# Altium schematic sheet LPCB218 - HEC5-8.SchDoc
size A3; Address1: Factory 10; Address2: 9-13 Dingley Avenue, Dandeong, VICTORIA 3175, AUSTRALIA; DocumentNumber: 7; Revision: 1; SheetNumber: 7; SheetTotal: 14; Lockie__PCB_SUB_ASSEMBLY: HEC 5-8; Lockie__PCB_ASSEMBLY: Command Node; Lockie__LDL: LPCB218; Lockie__PCB_DESCRIPTION: Command Node
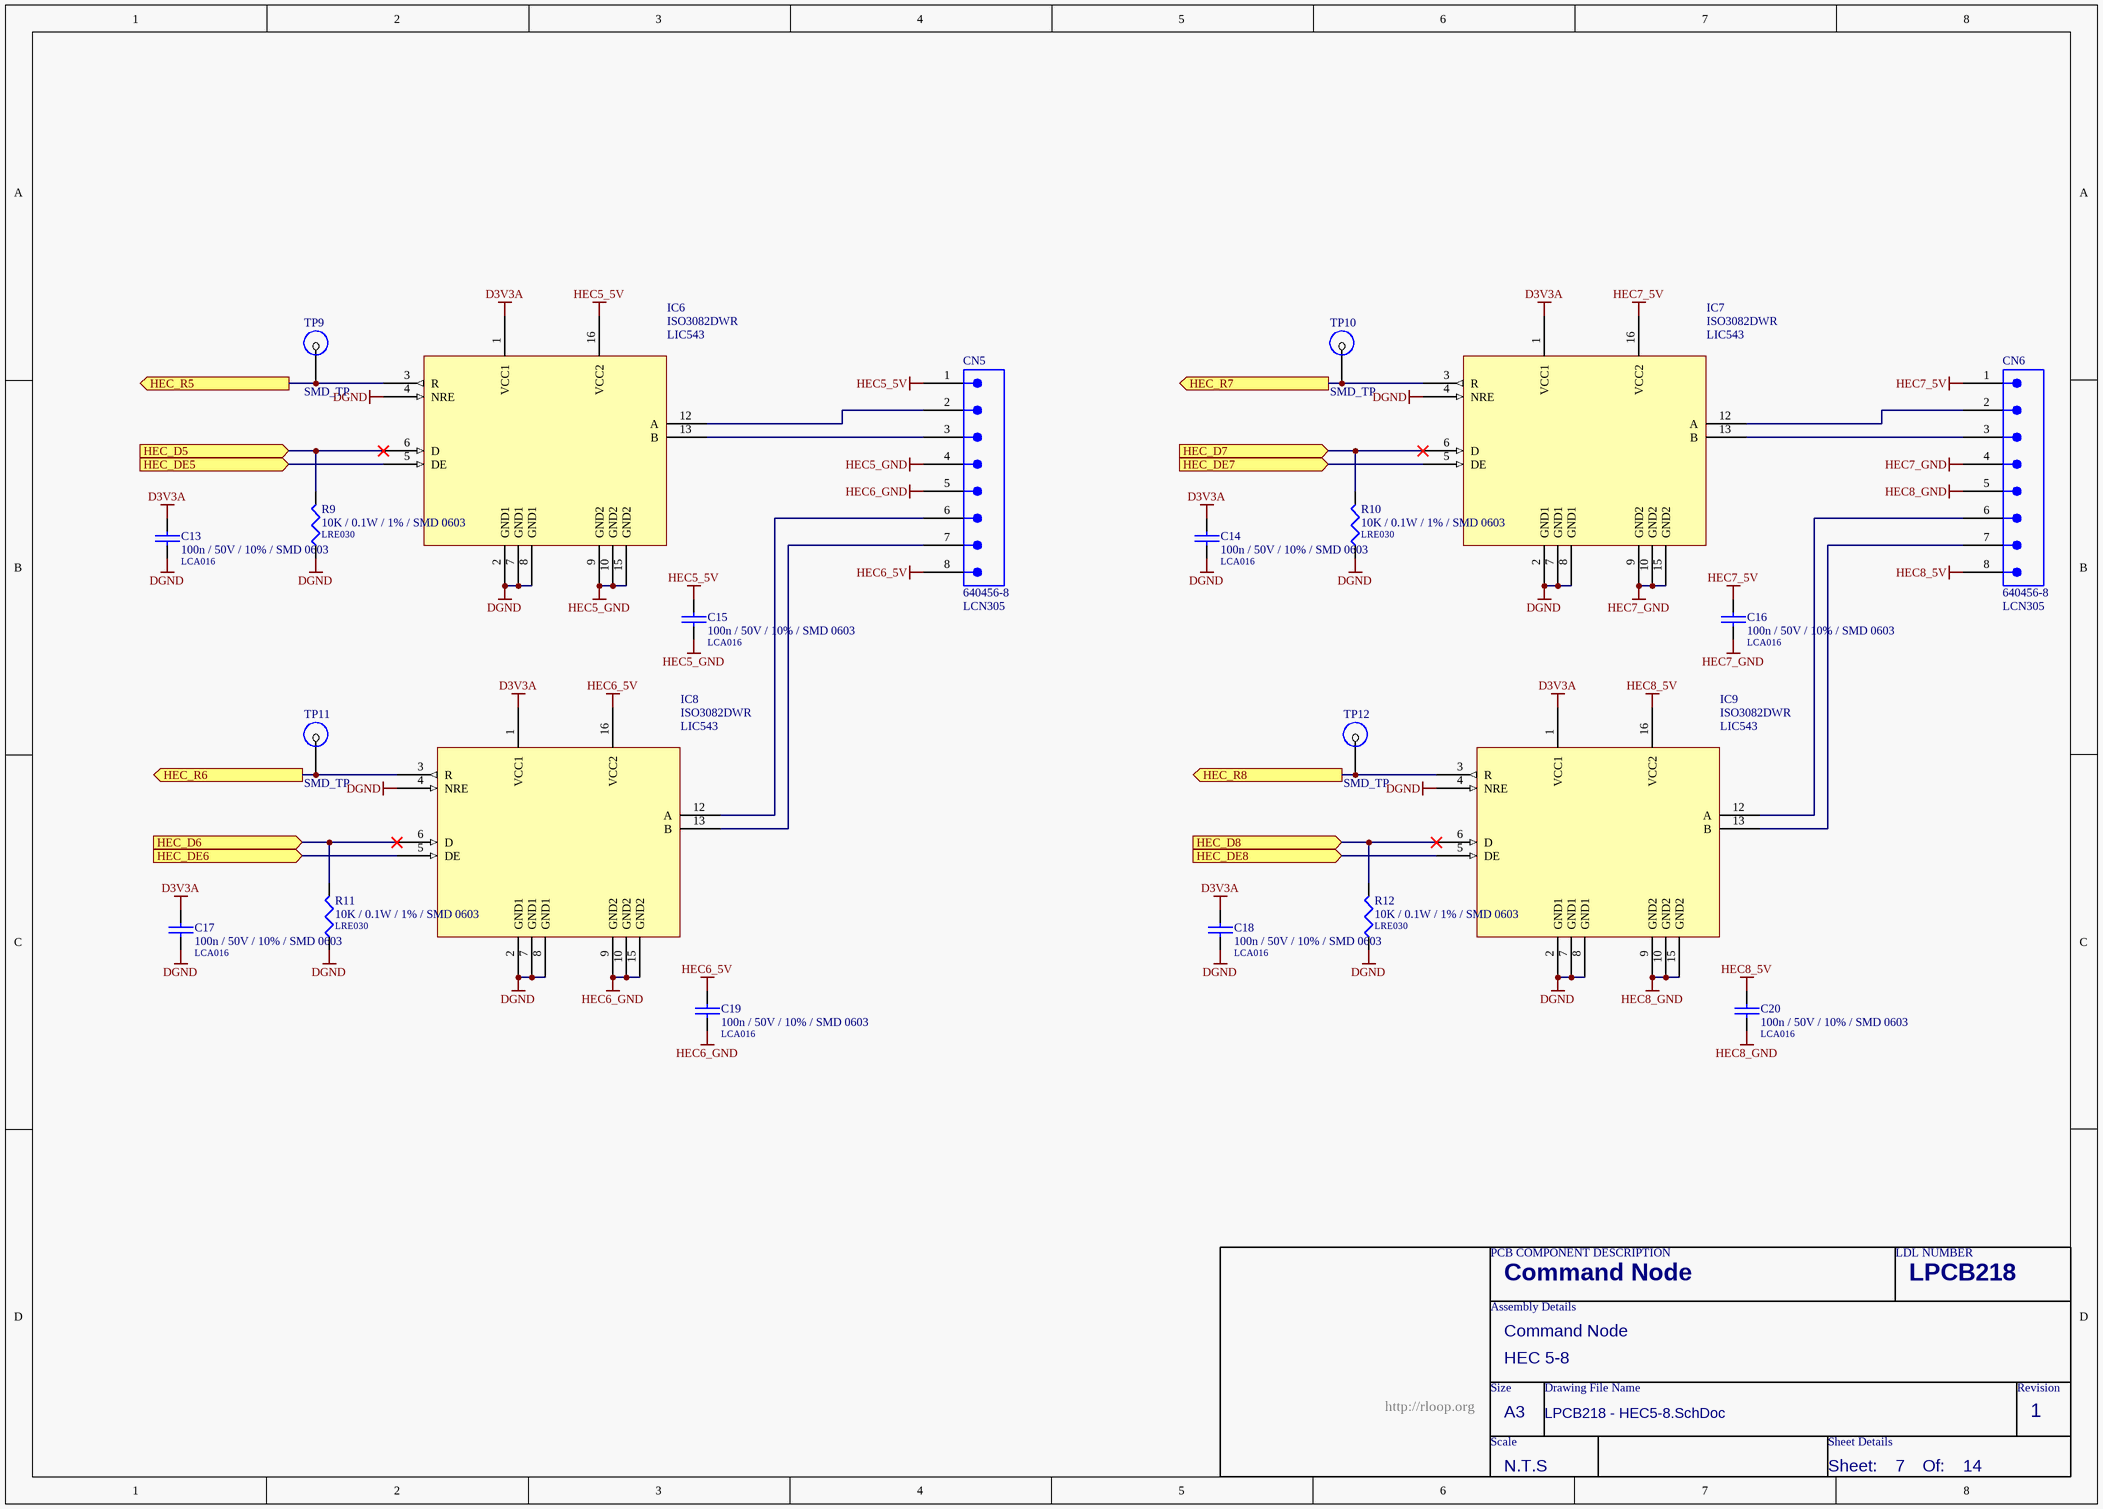
[diagram p0: LPCB218 - HEC5-8.SchDoc]

## Parts
C13  100n / 50V / 10% / SMD 0603  LDL_NUMBER: LCA016  [LFP011__CC1608-0603-IPC7351_B]
C14  100n / 50V / 10% / SMD 0603  LDL_NUMBER: LCA016  [LFP011__CC1608-0603-IPC7351_B]
C15  100n / 50V / 10% / SMD 0603  LDL_NUMBER: LCA016  [LFP011__CC1608-0603-IPC7351_B]
C16  100n / 50V / 10% / SMD 0603  LDL_NUMBER: LCA016  [LFP011__CC1608-0603-IPC7351_B]
C17  100n / 50V / 10% / SMD 0603  LDL_NUMBER: LCA016  [LFP011__CC1608-0603-IPC7351_B]
C18  100n / 50V / 10% / SMD 0603  LDL_NUMBER: LCA016  [LFP011__CC1608-0603-IPC7351_B]
C19  100n / 50V / 10% / SMD 0603  LDL_NUMBER: LCA016  [LFP011__CC1608-0603-IPC7351_B]
C20  100n / 50V / 10% / SMD 0603  LDL_NUMBER: LCA016  [LFP011__CC1608-0603-IPC7351_B]
CN5  640456-8  LDL_NUMBER: LCN305  [640456-8]
CN6  640456-8  LDL_NUMBER: LCN305  [640456-8]
IC6  ISO3082DWR  LDL_NUMBER: LIC543  [LFP068__SO-G16/G6.9]
IC7  ISO3082DWR  LDL_NUMBER: LIC543  [LFP068__SO-G16/G6.9]
IC8  ISO3082DWR  LDL_NUMBER: LIC543  [LFP068__SO-G16/G6.9]
IC9  ISO3082DWR  LDL_NUMBER: LIC543  [LFP068__SO-G16/G6.9]
R9  10K / 0.1W / 1% / SMD 0603  LDL_NUMBER: LRE030  [LFP020__CR1608-0603-IPC7351_B]
R10  10K / 0.1W / 1% / SMD 0603  LDL_NUMBER: LRE030  [LFP020__CR1608-0603-IPC7351_B]
R11  10K / 0.1W / 1% / SMD 0603  LDL_NUMBER: LRE030  [LFP020__CR1608-0603-IPC7351_B]
R12  10K / 0.1W / 1% / SMD 0603  LDL_NUMBER: LRE030  [LFP020__CR1608-0603-IPC7351_B]
TP9  SMD_TP  [SMD-TP]  (no BOM)
TP10  SMD_TP  [SMD-TP]  (no BOM)
TP11  SMD_TP  [SMD-TP]  (no BOM)
TP12  SMD_TP  [SMD-TP]  (no BOM)

## Ports
HEC_D5 (in), HEC_D6 (in), HEC_D7 (in), HEC_D8 (in), HEC_DE5 (in), HEC_DE6 (in), HEC_DE7 (in), HEC_DE8 (in), HEC_R5 (out), HEC_R6 (out), HEC_R7 (out), HEC_R8 (out)

## Nets
D3V3A: C13.1 C14.1 C17.1 C18.1 IC6.1(VCC1) IC7.1(VCC1) IC8.1(VCC1) IC9.1(VCC1)
DGND: C13.2 C14.2 C17.2 C18.2 IC6.2(GND1) IC6.4(NRE) IC6.7(GND1) IC6.8(GND1) IC7.2(GND1) IC7.4(NRE) IC7.7(GND1) IC7.8(GND1) IC8.2(GND1) IC8.4(NRE) IC8.7(GND1) IC8.8(GND1) IC9.2(GND1) IC9.4(NRE) IC9.7(GND1) IC9.8(GND1) R9.1 R10.1 R11.1 R12.1
HEC5_5V: C15.1 CN5.1 IC6.16(VCC2)
HEC5_GND: C15.2 CN5.4 IC6.9(GND2) IC6.10(GND2) IC6.15(GND2)
HEC6_5V: C19.1 CN5.8 IC8.16(VCC2)
HEC6_GND: C19.2 CN5.5 IC8.9(GND2) IC8.10(GND2) IC8.15(GND2)
HEC7_5V: C16.1 CN6.1 IC7.16(VCC2)
HEC7_GND: C16.2 CN6.4 IC7.9(GND2) IC7.10(GND2) IC7.15(GND2)
HEC8_5V: C20.1 CN6.8 IC9.16(VCC2)
HEC8_GND: C20.2 CN6.5 IC9.9(GND2) IC9.10(GND2) IC9.15(GND2)
HEC_D5: IC6.6(D) R9.2 ; port HEC_D5
HEC_D6: IC8.6(D) R11.2 ; port HEC_D6
HEC_D7: IC7.6(D) R10.2 ; port HEC_D7
HEC_D8: IC9.6(D) R12.2 ; port HEC_D8
HEC_DE5: IC6.5(DE) ; port HEC_DE5
HEC_DE6: IC8.5(DE) ; port HEC_DE6
HEC_DE7: IC7.5(DE) ; port HEC_DE7
HEC_DE8: IC9.5(DE) ; port HEC_DE8
HEC_R5: IC6.3(R) TP9.1 ; port HEC_R5
HEC_R6: IC8.3(R) TP11.1 ; port HEC_R6
HEC_R7: IC7.3(R) TP10.1 ; port HEC_R7
HEC_R8: IC9.3(R) TP12.1 ; port HEC_R8
NetCN5_2: CN5.2 IC6.12(A)
NetCN5_3: CN5.3 IC6.13(B)
NetCN5_6: CN5.6 IC8.12(A)
NetCN5_7: CN5.7 IC8.13(B)
NetCN6_2: CN6.2 IC7.12(A)
NetCN6_3: CN6.3 IC7.13(B)
NetCN6_6: CN6.6 IC9.12(A)
NetCN6_7: CN6.7 IC9.13(B)

## Notes on the sheet
- PCB COMPONENT DESCRIPTION
- LDL NUMBER
- Assembly Details
- Size
- Drawing File Name
- Revision
- http://rloop.org
- Scale
- A3
- Sheet Details
- N.T.S
- Sheet:
- Of:

## Library data of the parts
C13-C20 = 100n / 50V / 10% / SMD 0603: Capacitor, Ceramic Chip, 100nF (0.1uF), 50V, 5%, SMD 0603 [LCA016]; FMEDA__OPERATING__VOLTAGE_MIN: 0; FMEDA__OPERATING__VOLTAGE_MAX: 3.3; FMEDA__OPERATING__TEMP_MIN: -20; FMEDA__OPERATING__TEMP_TYP: 27; FMEDA__OPERATING__TEMP_MAX: 50; FMEDA__CHANNEL: COM; Value: 100n; FMEDA__FUNCTION_IN_SYSTEM: *; FMEDA__OPERATING__VOLTAGE_TYP: 3.3
CN5 CN6 = 640456-8: Connector, Male Header, 8 Way; FMEDA__CHANNEL: COM; FMEDA__OPERATING__CURRENT_MAX: 0; FMEDA__OPERATING__TEMP_MAX: 50; FMEDA__OPERATING__TEMP_MIN: -20; FMEDA__OPERATING__TEMP_TYP: 27; FMEDA__OPERATING__VOLTAGE_MAX: 16; FMEDA__OPERATING__VOLTAGE_TYP: 12; FMEDA__FUNCTION_IN_SYSTEM: *; FMEDA__OPERATING__CURRENT_MIN: 0; FMEDA__OPERATING__CURRENT_TYP: 0; FMEDA__OPERATING__VOLTAGE_MIN: 0
IC6-IC9 = ISO3082DWR: IC, RS485 Isolator, SMD SOIC 16 [LIC543]
R9-R12 = 10K / 0.1W / 1% / SMD 0603: Resistor, Ceramic Chip, 10K, 0.1W, 1%, SMD 0603 [LRE030]; FMEDA__OPERATING__POWER_MAX: 0; FMEDA__OPERATING__TEMP_MAX: 50; FMEDA__OPERATING__TEMP_MIN: -20; FMEDA__OPERATING__TEMP_TYP: 27; FMEDA__CHANNEL: COM; Value: 10K; FMEDA__OPERATING__POWER_MIN: 0; FMEDA__OPERATING__VOLTAGE_MAX: 0; FMEDA__OPERATING__VOLTAGE_MIN: 0; FMEDA__OPERATING__VOLTAGE_TYP: 0; FMEDA__FUNCTION_IN_SYSTEM: *
TP9-TP12 = SMD_TP: SMD Test Point; FMEDA__CHANNEL: COM; FMEDA__OPERATING__CURRENT_MAX: 0; FMEDA__OPERATING__TEMP_MAX: 50; FMEDA__OPERATING__TEMP_MIN: -20; FMEDA__OPERATING__TEMP_TYP: 27; FMEDA__OPERATING__VOLTAGE_MAX: 16; FMEDA__OPERATING__VOLTAGE_TYP: 12; FMEDA__OPERATING__CURRENT_MIN: 0; FMEDA__OPERATING__CURRENT_TYP: 0; FMEDA__OPERATING__VOLTAGE_MIN: 0